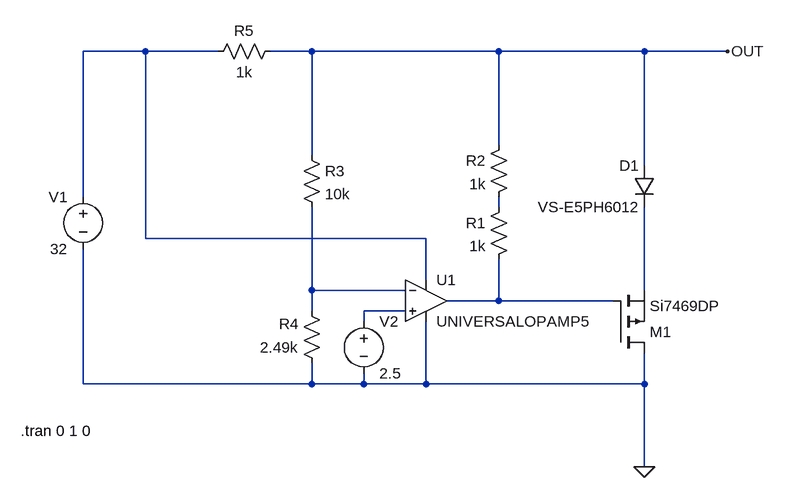
[diagram p0: schematic VOC_Generator_Circuit.asc]
VOC_Generator_Circuit.asc, the LTspice schematic file:
Version 4.1
SHEET 1 1124 1396
WIRE -224 736 -320 736
WIRE -112 736 -224 736
WIRE 32 736 -32 736
WIRE 320 736 32 736
WIRE 544 736 320 736
WIRE 672 736 544 736
WIRE 320 880 320 736
WIRE 32 896 32 736
WIRE 544 912 544 736
WIRE -320 960 -320 736
WIRE 320 976 320 960
WIRE -224 1024 -224 736
WIRE 208 1024 -224 1024
WIRE 208 1088 208 1024
WIRE 32 1104 32 976
WIRE 176 1104 32 1104
WIRE 544 1104 544 976
WIRE 320 1120 320 1056
WIRE 320 1120 240 1120
WIRE 496 1120 320 1120
WIRE 32 1136 32 1104
WIRE 176 1136 112 1136
WIRE 112 1152 112 1136
WIRE -320 1248 -320 1040
WIRE 32 1248 32 1216
WIRE 32 1248 -320 1248
WIRE 112 1248 112 1232
WIRE 112 1248 32 1248
WIRE 208 1248 208 1152
WIRE 208 1248 112 1248
WIRE 544 1248 544 1200
WIRE 544 1248 208 1248
WIRE 544 1376 544 1248
FLAG 672 736 OUT
FLAG 544 1376 0
SYMBOL diode 560 912 M0
SYMATTR InstName D1
SYMATTR Value VS-E5PH6012
SYMBOL pmos 496 1200 M180
SYMATTR InstName M1
SYMATTR Value Si7469DP
SYMBOL res 336 960 M0
SYMATTR InstName R1
SYMATTR Value 1k
SYMBOL res 336 864 M0
SYMATTR InstName R2
SYMATTR Value 1k
SYMBOL res 16 880 R0
SYMATTR InstName R3
SYMATTR Value 10k
SYMBOL res 48 1232 R180
WINDOW 0 36 76 Left 2
WINDOW 3 36 40 Left 2
SYMATTR InstName R4
SYMATTR Value 2.49k
SYMBOL res -128 752 R270
WINDOW 0 32 56 VTop 2
WINDOW 3 0 56 VBottom 2
SYMATTR InstName R5
SYMATTR Value 1k
SYMBOL voltage -320 944 M0
WINDOW 123 0 0 Left 0
WINDOW 39 0 0 Left 0
SYMATTR InstName V1
SYMATTR Value 32
SYMBOL OpAmps\\UniversalOpAmp5 208 1120 R0
SYMATTR InstName U1
SYMATTR Value2 Avol=1G GBW=10G Phimargin=90 SlewPos=10Meg SlewNeg=10Meg
SYMBOL voltage 112 1136 R0
WINDOW 123 0 0 Left 0
WINDOW 39 0 0 Left 0
SYMATTR InstName V2
SYMATTR Value 2.5
TEXT -416 1320 Left 2 !.tran 0 1 0

The netlist it stands for:
* VOC_Generator_Circuit.asc
D1 OUT N004 VS-E5PH6012
M1 0 N005 N004 N004 Si7469DP
R1 N002 N005 1k
R2 OUT N002 1k
R3 OUT N003 10k
R4 0 N003 2.49k
R5 N001 OUT 1k
V1 N001 0 32
X§U1 N006 N003 N001 0 N005 Avol=1G GBW=10G Phimargin=90 SlewPos=10Meg SlewNeg=10Meg  ; UNIVERSALOPAMP5, pins In+ In- V+ V- OUT
V2 N006 0 2.5
.model D D
.lib standard.dio
.model NMOS NMOS
.model PMOS PMOS
.lib standard.mos
.tran 0 1 0
.backanno
.end